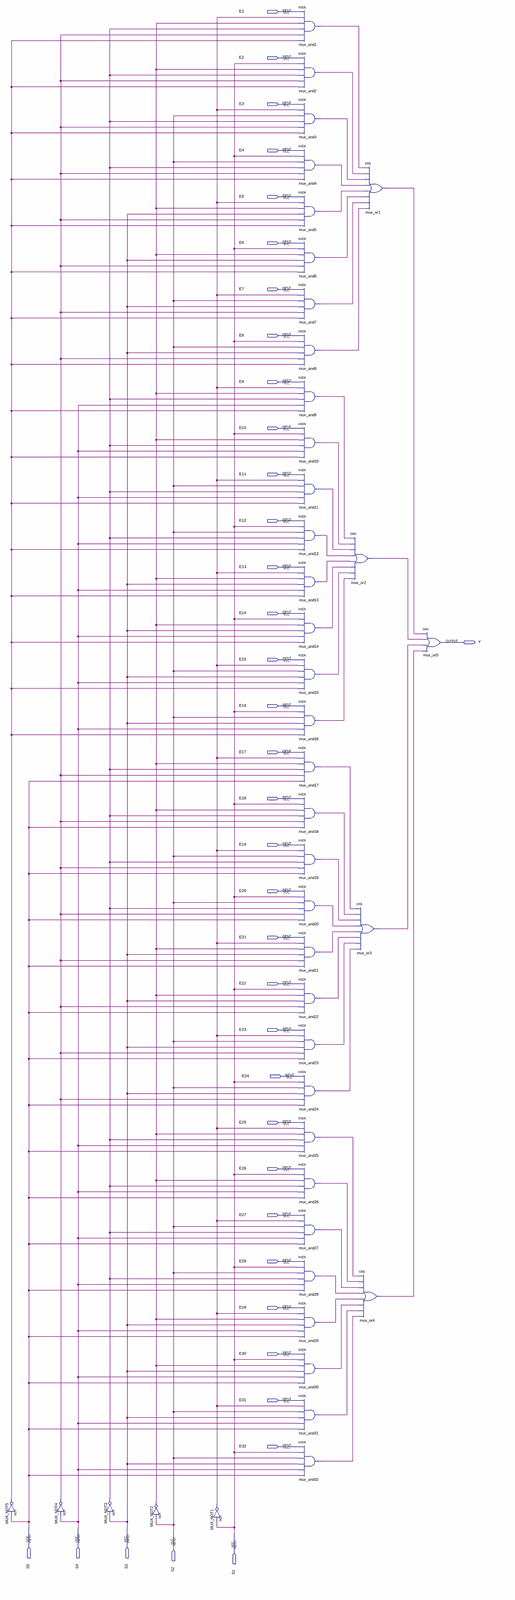
[diagram p0: schematic sheet, whole]
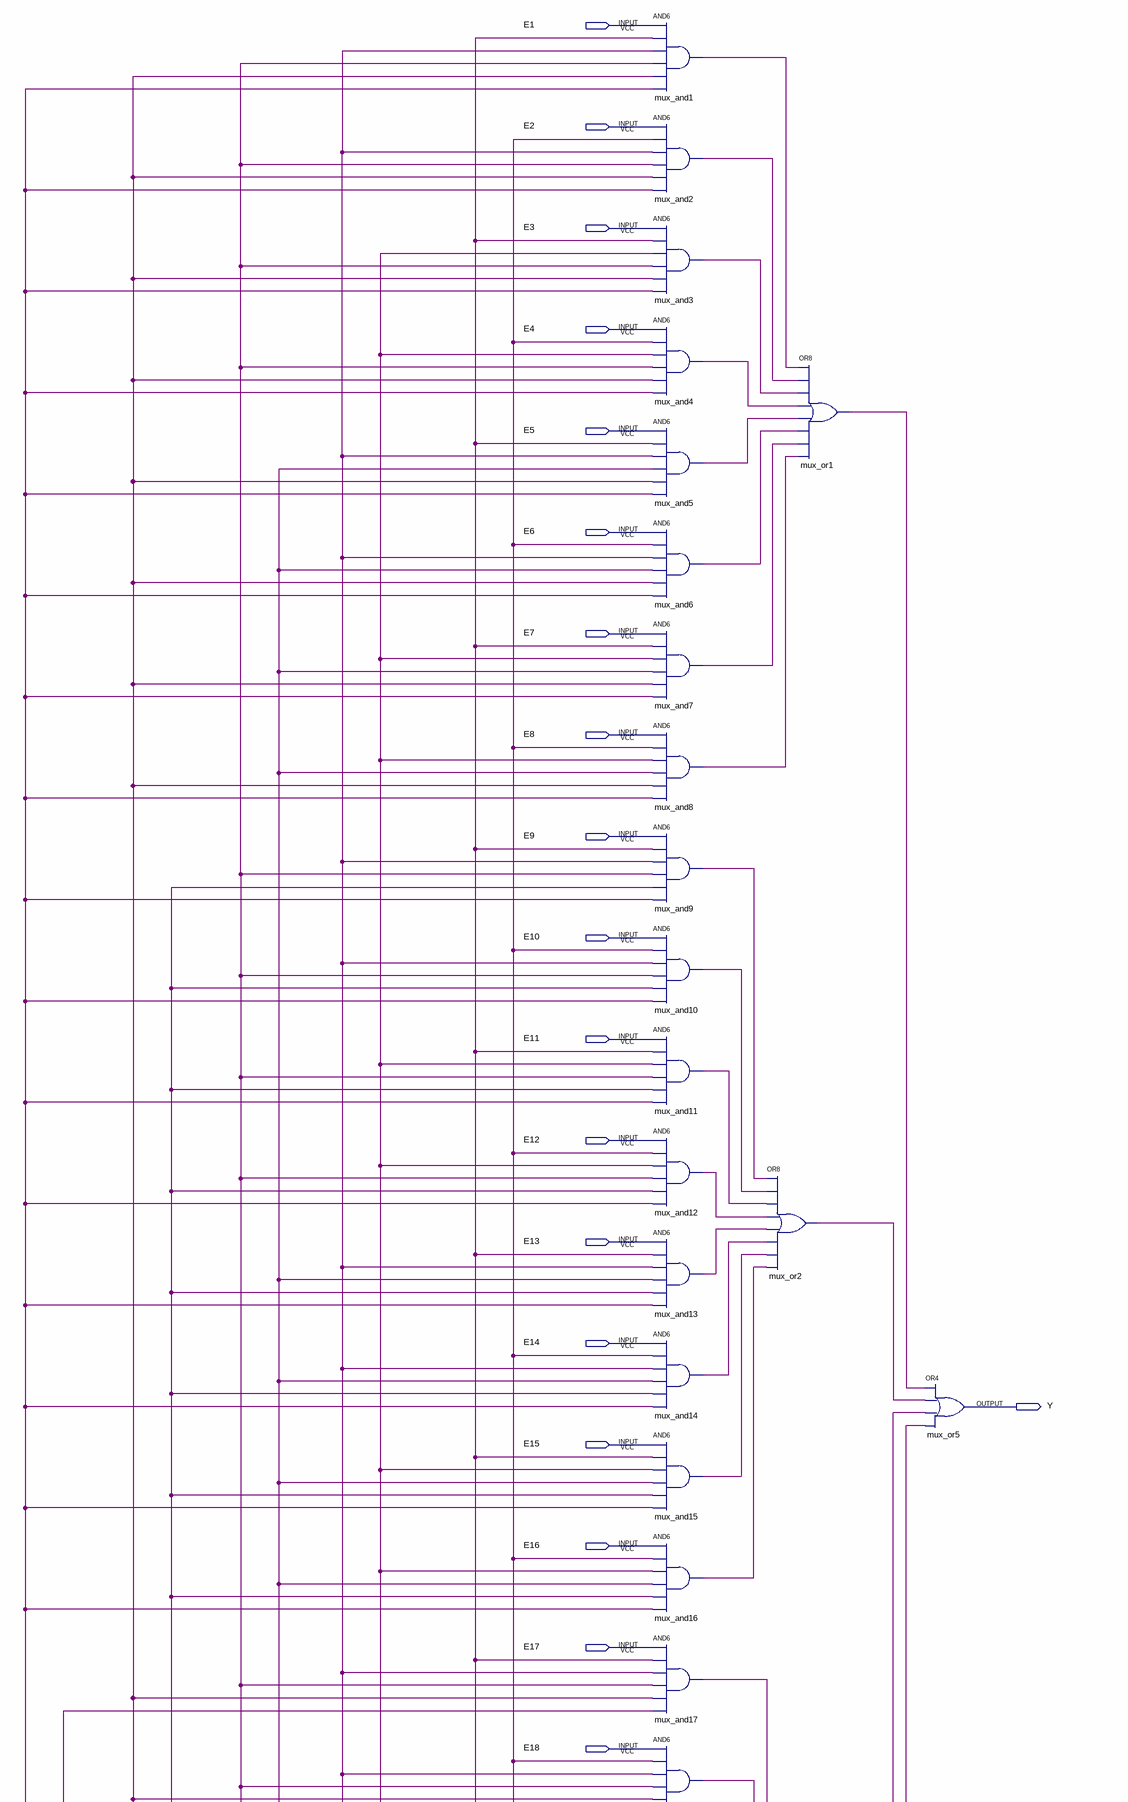
[diagram p1: schematic sheet, upper part]
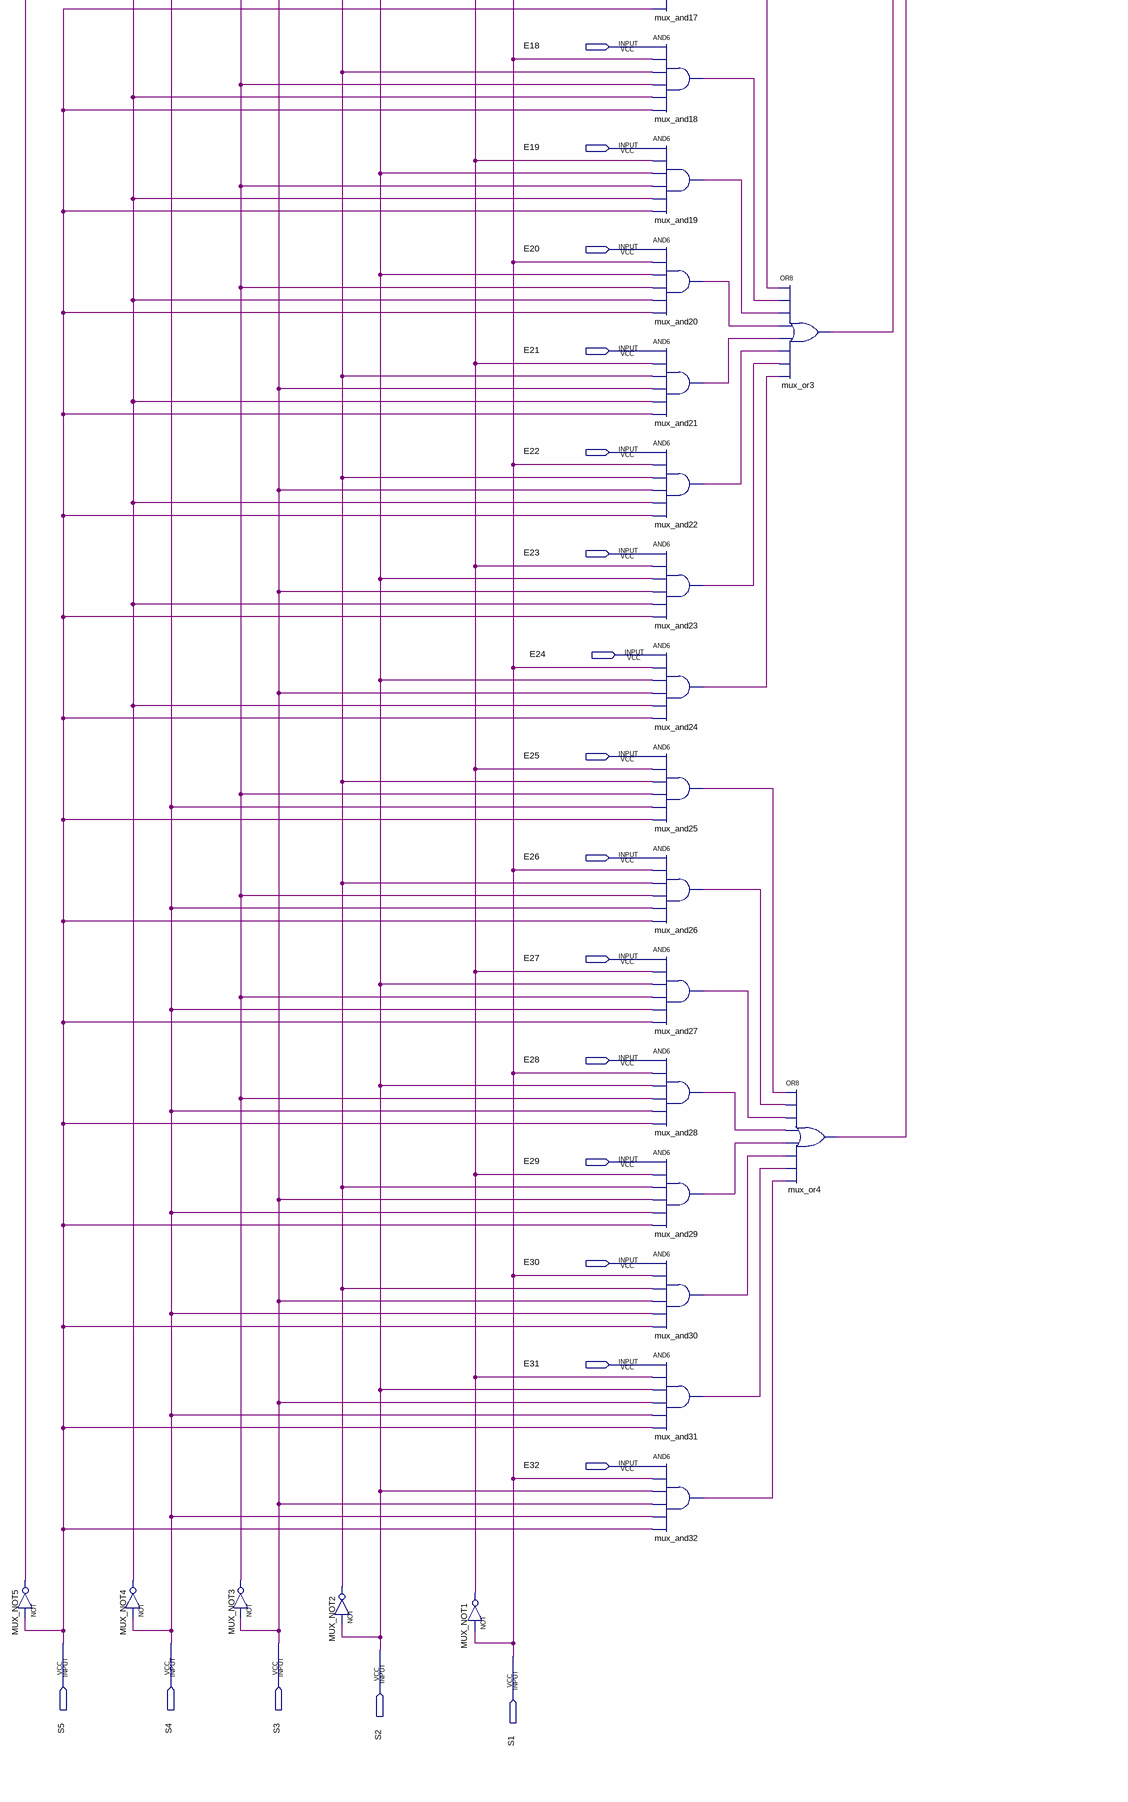
[diagram p2: schematic sheet, lower part]
// Quartus schematic mux32.bdf as structural Verilog: 42 symbols, 38 pins
module mux32 (
  input  E1,
  input  E2,
  input  E3,
  input  E4,
  input  E5,
  input  E6,
  input  E7,
  input  E8,
  input  E9,
  input  E10,
  input  E11,
  input  E12,
  input  E13,
  input  E14,
  input  E15,
  input  E16,
  input  E17,
  input  E18,
  input  E19,
  input  E20,
  input  E21,
  input  E22,
  input  E23,
  input  E24,
  input  E25,
  input  E26,
  input  E27,
  input  E28,
  input  E29,
  input  E30,
  input  E31,
  input  E32,
  input  S5,
  input  S4,
  input  S3,
  input  S2,
  input  S1,
  output Y
);

  wire mux_and1_out, mux_and2_out, mux_and3_out, mux_and4_out, mux_and5_out, mux_and6_out, mux_and7_out,
       mux_and8_out, mux_and9_out, mux_and10_out, mux_and11_out, mux_and12_out, mux_and13_out, mux_and14_out,
       mux_and15_out, mux_and16_out, mux_and17_out, mux_and18_out, mux_and19_out, mux_and20_out,
       mux_and21_out, mux_and22_out, mux_and23_out, mux_and24_out, mux_and25_out, mux_and26_out,
       mux_and27_out, mux_and28_out, mux_and29_out, mux_and30_out, mux_and31_out, mux_and32_out,
       MUX_NOT1_out, MUX_NOT2_out, MUX_NOT3_out, MUX_NOT4_out, MUX_NOT5_out, mux_or1_out, mux_or2_out,
       mux_or3_out, mux_or4_out;

  not MUX_NOT5 (MUX_NOT5_out, S5);
  not MUX_NOT4 (MUX_NOT4_out, S4);
  not MUX_NOT3 (MUX_NOT3_out, S3);
  not MUX_NOT2 (MUX_NOT2_out, S2);
  not MUX_NOT1 (MUX_NOT1_out, S1);
  and mux_and1 (mux_and1_out, E1, MUX_NOT1_out, MUX_NOT2_out, MUX_NOT3_out, MUX_NOT4_out, MUX_NOT5_out);
  and mux_and2 (mux_and2_out, E2, S1, MUX_NOT2_out, MUX_NOT3_out, MUX_NOT4_out, MUX_NOT5_out);
  and mux_and3 (mux_and3_out, E3, MUX_NOT1_out, S2, MUX_NOT3_out, MUX_NOT4_out, MUX_NOT5_out);
  and mux_and4 (mux_and4_out, E4, S1, S2, MUX_NOT3_out, MUX_NOT4_out, MUX_NOT5_out);
  and mux_and5 (mux_and5_out, E5, MUX_NOT1_out, MUX_NOT2_out, S3, MUX_NOT4_out, MUX_NOT5_out);
  and mux_and6 (mux_and6_out, E6, S1, MUX_NOT2_out, S3, MUX_NOT4_out, MUX_NOT5_out);
  and mux_and7 (mux_and7_out, E7, MUX_NOT1_out, S2, S3, MUX_NOT4_out, MUX_NOT5_out);
  and mux_and8 (mux_and8_out, E8, S1, S2, S3, MUX_NOT4_out, MUX_NOT5_out);
  and mux_and9 (mux_and9_out, E9, MUX_NOT1_out, MUX_NOT2_out, MUX_NOT3_out, S4, MUX_NOT5_out);
  and mux_and10 (mux_and10_out, E10, S1, MUX_NOT2_out, MUX_NOT3_out, S4, MUX_NOT5_out);
  and mux_and11 (mux_and11_out, E11, MUX_NOT1_out, S2, MUX_NOT3_out, S4, MUX_NOT5_out);
  and mux_and12 (mux_and12_out, E12, S1, S2, MUX_NOT3_out, S4, MUX_NOT5_out);
  and mux_and13 (mux_and13_out, E13, MUX_NOT1_out, MUX_NOT2_out, S3, S4, MUX_NOT5_out);
  and mux_and14 (mux_and14_out, E14, S1, MUX_NOT2_out, S3, S4, MUX_NOT5_out);
  and mux_and15 (mux_and15_out, E15, MUX_NOT1_out, S2, S3, S4, MUX_NOT5_out);
  and mux_and16 (mux_and16_out, E16, S1, S2, S3, S4, MUX_NOT5_out);
  and mux_and17 (mux_and17_out, E17, MUX_NOT1_out, MUX_NOT2_out, MUX_NOT3_out, MUX_NOT4_out, S5);
  and mux_and18 (mux_and18_out, E18, S1, MUX_NOT2_out, MUX_NOT3_out, MUX_NOT4_out, S5);
  and mux_and19 (mux_and19_out, E19, MUX_NOT1_out, S2, MUX_NOT3_out, MUX_NOT4_out, S5);
  and mux_and20 (mux_and20_out, E20, S1, S2, MUX_NOT3_out, MUX_NOT4_out, S5);
  and mux_and21 (mux_and21_out, E21, MUX_NOT1_out, MUX_NOT2_out, S3, MUX_NOT4_out, S5);
  and mux_and22 (mux_and22_out, E22, S1, MUX_NOT2_out, S3, MUX_NOT4_out, S5);
  and mux_and23 (mux_and23_out, E23, MUX_NOT1_out, S2, S3, MUX_NOT4_out, S5);
  and mux_and24 (mux_and24_out, S1, S2, S3, MUX_NOT4_out, S5);  // open: IN1
  and mux_and25 (mux_and25_out, E25, MUX_NOT1_out, MUX_NOT2_out, MUX_NOT3_out, S4, S5);
  and mux_and26 (mux_and26_out, E26, S1, MUX_NOT2_out, MUX_NOT3_out, S4, S5);
  and mux_and27 (mux_and27_out, E27, MUX_NOT1_out, S2, MUX_NOT3_out, S4, S5);
  and mux_and28 (mux_and28_out, E28, S1, S2, MUX_NOT3_out, S4, S5);
  and mux_and29 (mux_and29_out, E29, MUX_NOT1_out, MUX_NOT2_out, S3, S4, S5);
  and mux_and30 (mux_and30_out, E30, S1, MUX_NOT2_out, S3, S4, S5);
  and mux_and31 (mux_and31_out, E31, MUX_NOT1_out, S2, S3, S4, S5);
  and mux_and32 (mux_and32_out, E32, S1, S2, S3, S4, S5);
  or mux_or1 (mux_or1_out, mux_and1_out, mux_and2_out, mux_and3_out, mux_and4_out, mux_and5_out, mux_and6_out, mux_and7_out, mux_and8_out);
  or mux_or2 (mux_or2_out, mux_and9_out, mux_and10_out, mux_and11_out, mux_and12_out, mux_and13_out, mux_and14_out, mux_and15_out, mux_and16_out);
  or mux_or3 (mux_or3_out, mux_and17_out, mux_and18_out, mux_and19_out, mux_and20_out, mux_and21_out, mux_and22_out, mux_and23_out, mux_and24_out);
  or mux_or4 (mux_or4_out, mux_and25_out, mux_and26_out, mux_and27_out, mux_and28_out, mux_and29_out, mux_and30_out, mux_and31_out, mux_and32_out);
  or mux_or5 (Y, mux_or1_out, mux_or2_out, mux_or3_out, mux_or4_out);
endmodule
